# Altium schematic sheet [3] Voltage Converters.SchDoc
size A4; Organization: Altium Limited; Address1: L3, 12a Rodborough Rd; Address2: Frenchs Forest; Address3: NSW; Address4: Australia 2086
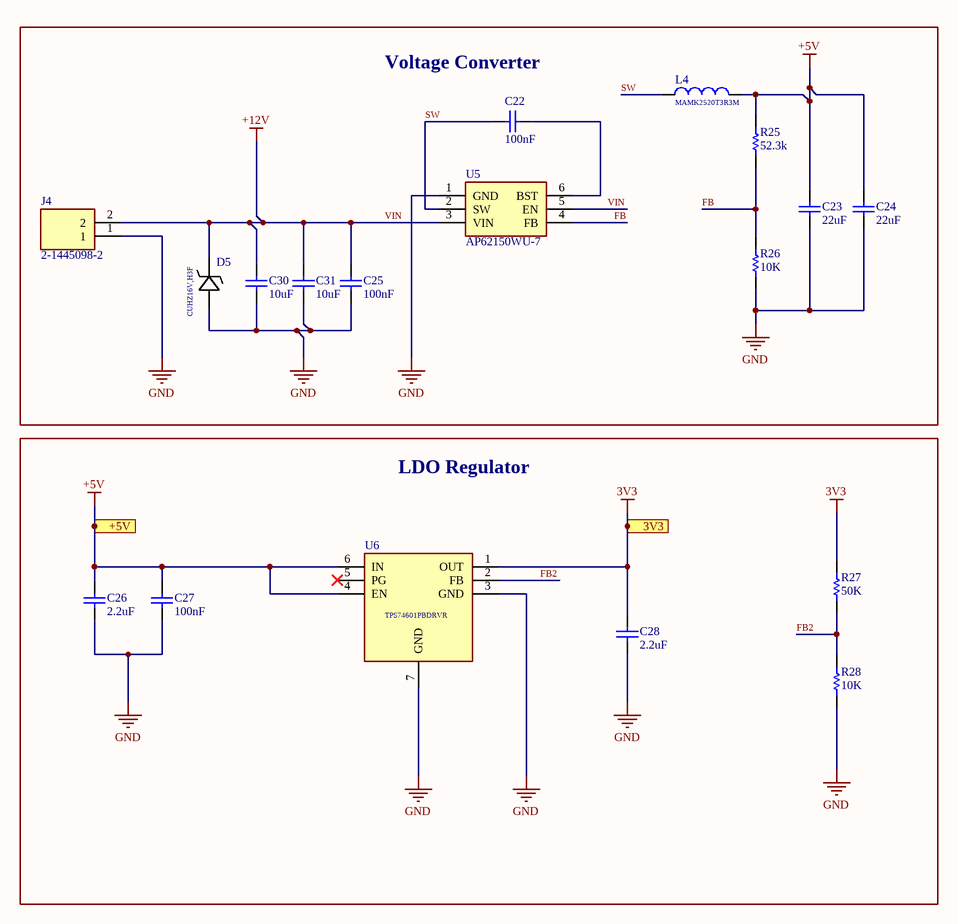
[diagram p0: [3] Voltage Converters.SchDoc]

## Parts
C22  100nF  [Capacitor 0402]
C23  22uF  [CAPACITOR 0805]
C24  22uF  [CAPACITOR 0805]
C25  100nF  [Capacitor 0402]
C26  2.2uF  [CAPACITOR 0805]
C27  100nF  [Capacitor 0402]
C28  2.2uF  [CAPACITOR 0805]
C30  10uF  [CAPACITOR 0805]
C31  10uF  [CAPACITOR 0805]
D5  CUHZ16V,H3F  [SOD-323HEUS2H_TOS]
J4  2-1445098-2  [214450982]
L4  MAMK2520T3R3M  [INDC2520X120N]
R25  52.3k  [Resistencia 0402]
R26  10K  [Resistencia 0402]
R27  50K  [Resistencia 0402]
R28  10K  [Resistencia 0402]
U5  AP62150WU-7  [SOT95P280X100-6N]
U6  TPS74601PBDRVR  [SON65P200X200X80-7N]

## Blocks framed on the sheet
Voltage Converter: C22-C25 C30 C31 D5 J4 L4 R25 R26 U5
LDO Regulator: C26-C28 R27 R28 U6

## Ports
3V3, +5V

## Nets
3V3: C28.2 R27.2(B) U6.1(OUT) ; port 3V3
+5V: C23.2 C24.2 C26.2 C27.2 L4.2 R25.2(B) U6.4(EN) U6.6(IN) ; port +5V
GND: C23.1 C24.1 C25.1 C26.1 C27.1 C28.1 C30.1 C31.1 D5.2(ANODE) J4.1 R26.1(A) R28.1(A) U5.1(GND) U6.3(GND) U6.7(GND)
VIN: C25.2 C30.2 C31.2 D5.1(CATHODE) J4.2 U5.3(VIN) U5.5(EN)  [also labelled +12V]
FB: R25.1(A) R26.2(B) U5.4(FB)
FB2: R27.1(A) R28.2(B) U6.2(FB)
SW: C22.2 L4.1 U5.2(SW)
NetC22_1: C22.1 U5.6(BST)

Not connected (* = marked no-connect by the designer): U6 5(PG)*

## Notes on the sheet
- Title
- Size:
- Date:
- A4
- Number:
- Time:
- Revision:
- Sheet
- of
- File:

## Library data of the parts
C22 C25 C27 = Capacitor 0402: Capacitor Ceramico SMD 0402
C23 C24 C26 C28 C30 C31 = Capacitor 0805: Capacitor Cerámico SMD 0805
D5 = CUHZ16V,H3F: 16 V TVS Diode, SOD-323HE(US2H); Manufacturer_Name: Toshiba Electronic Devices & Storage Corp.; Copyright: Copyright (C) 2025 Ultra Librarian. All rights reserved.; Manufacturer_Part_Number: CUHZ16V,H3F
J4 = 2-1445098-2: Configuration Features: Number of Rows 1; Manufacturer_Name: TE Connectivity; Geometry.Height: 5.67mm; Mouser Part Number: 571-2-1445098-2; Mouser Price/Stock: https://www.mouser.co.uk/ProductDetail/TE-Connectivity-AMP/2-1445098-2?qs=Eu63EZxBwKKSsdV7%2Fa6T1Q%3D%3D; Manufacturer_Part_Number: 2-1445098-2; Datasheet Link: https://www.te.com/commerce/DocumentDelivery/DDEController?Action=srchrtrv&DocNm=micro-mate-n-lok-connector-qrg&DocType=Data%20Sheet&DocLang=English&PartCntxt=2-1445098-2&DocFormat=pdf
L4 = MAMK2520T3R3M: 3.3 ÂµH Shielded Drum Core, Wirewound Inductor 1.7 A 156mOhm Max 1008 (2520 Metric); MF: Taiyo Yuden; SnapEDA_Link: https://www.snapeda.com/parts/MAMK2520T3R3M/Taiyo+Yuden/view-part/?ref=snap; Package: 2520 Taiyo Yuden; Value: *; MP: MAMK2520T3R3M; Check_prices: https://www.snapeda.com/parts/MAMK2520T3R3M/Taiyo+Yuden/view-part/?ref=eda
R25-R28 = Resistencia SMD 0402
U5 = AP62150WU-7: Switching Voltage Regulators DCDC Conv HV Buck TSOT26 T&R 3K; Manufacturer_Name: Diodes Incorporated; Geometry.Height: 1mm; Mouser Part Number: 621-AP62150WU-7; Mouser Price/Stock: https://www.mouser.co.uk/ProductDetail/Diodes-Incorporated/AP62150WU-7?qs=yqaQSyyJnNgGPHe5Vg29cg%3D%3D; Manufacturer_Part_Number: AP62150WU-7; Datasheet Link: https://www.diodes.com//assets/Datasheets/AP62150.pdf
U6 = TPS74601PBDRVR: Adjustable 1-A low-dropout (LDO) linear regulator with power good; Manufacturer_Name: Texas Instruments; Geometry.Height: 0.8mm; Mouser Part Number: 595-TPS74601PBDRVR; Mouser Price/Stock: https://www.mouser.co.uk/ProductDetail/Texas-Instruments/TPS74601PBDRVR?qs=PqoDHHvF64%252B93w4aKhWy6Q%3D%3D; Manufacturer_Part_Number: TPS74601PBDRVR; Datasheet Link: http://www.ti.com/lit/gpn/TPS746